# Altium schematic sheet Sheet1.SchDoc
size A4
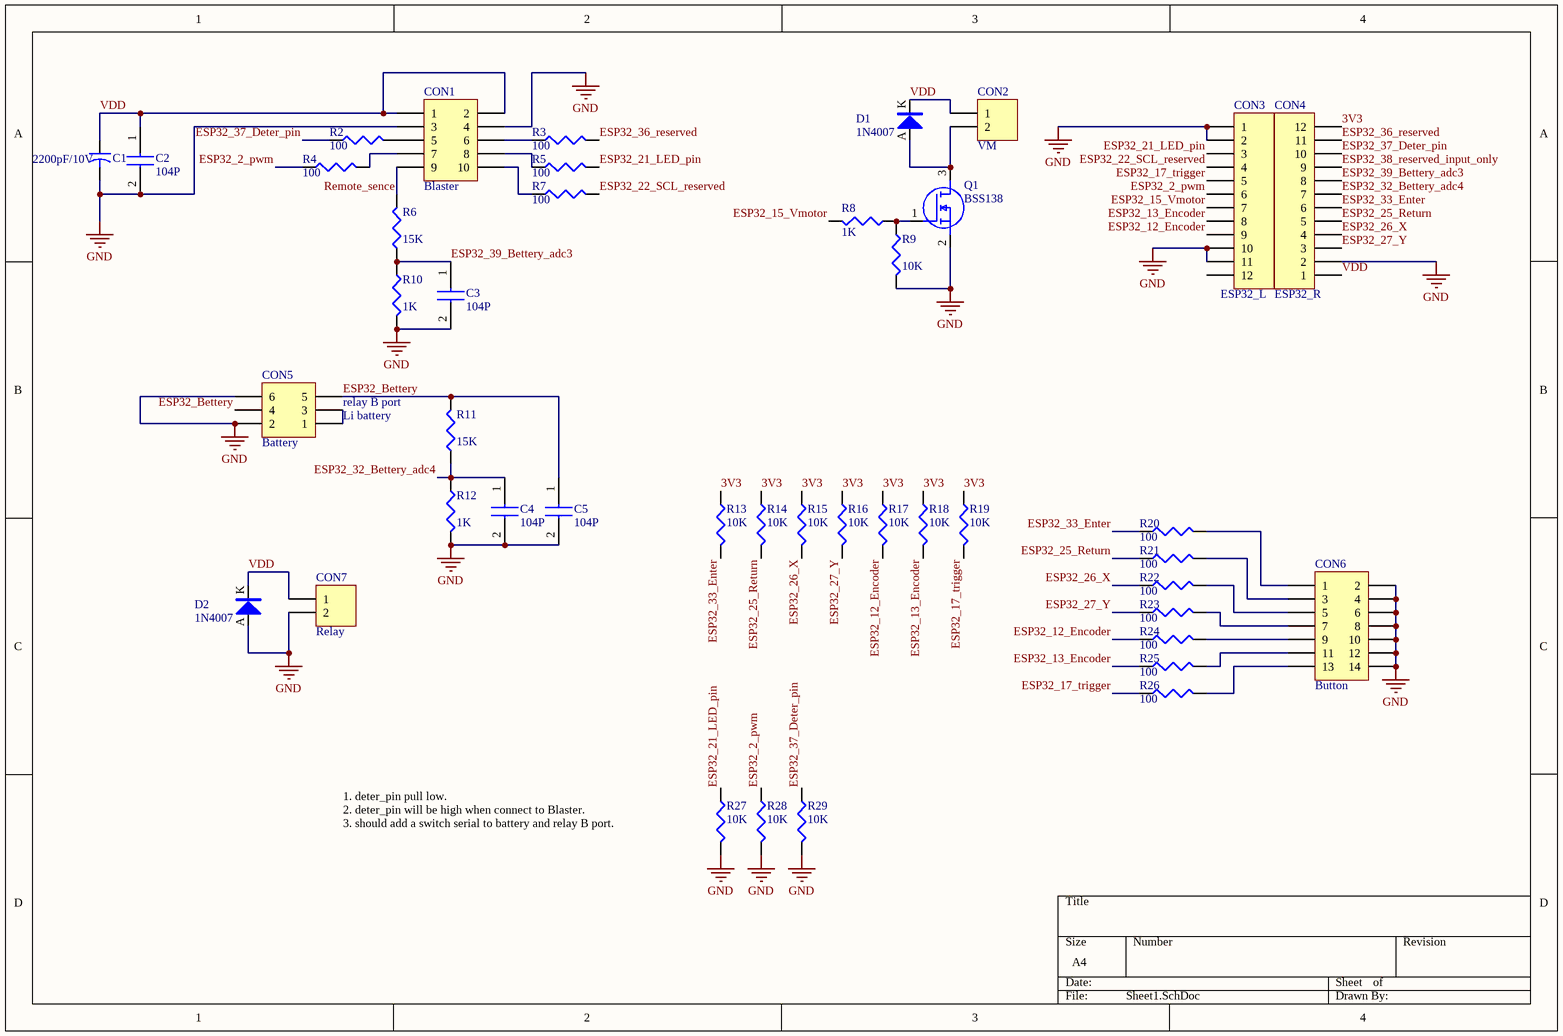
[diagram p0: Sheet1.SchDoc]

## Parts
C1  value 2200pF/10V  [CAPR5-4X5]  (hidden comment: Cap2)
C2  104P  [CAPC1608X90N]
C3  104P  [CAPC1608X90N]
C4  104P  [CAPC1608X90N]
C5  104P  [CAPC1608X90N]
CON1  Blaster  [HDR2X5]
CON2  VM  [HDR1X2]
CON3  ESP32_L  [HDR1X12]
CON4  ESP32_R  [HDR1X12]
CON5  Battery  [HDR2X3]
CON6  Button  [HDR2X7]
CON7  Relay  [HDR1X2]
D1  1N4007  [D3216]
D2  1N4007  [D3216]
Q1  BSS138  [SOT95P240X120-3N]
R2  value 100  [J1-0603]  (hidden comment: Res3)
R3  value 100  [J1-0603]  (hidden comment: Res3)
R4  value 100  [J1-0603]  (hidden comment: Res3)
R5  value 100  [J1-0603]  (hidden comment: Res3)
R6  value 15K  [J1-0603]  (hidden comment: Res3)
R7  value 100  [J1-0603]  (hidden comment: Res3)
R8  value 1K  [J1-0603]  (hidden comment: Res3)
R9  value 10K  [J1-0603]  (hidden comment: Res3)
R10  value 1K  [J1-0603]  (hidden comment: Res3)
R11  value 15K  [J1-0603]  (hidden comment: Res3)
R12  value 1K  [J1-0603]  (hidden comment: Res3)
R13  value 10K  [J1-0603]  (hidden comment: Res3)
R14  value 10K  [J1-0603]  (hidden comment: Res3)
R15  value 10K  [J1-0603]  (hidden comment: Res3)
R16  value 10K  [J1-0603]  (hidden comment: Res3)
R17  value 10K  [J1-0603]  (hidden comment: Res3)
R18  value 10K  [J1-0603]  (hidden comment: Res3)
R19  value 10K  [J1-0603]  (hidden comment: Res3)
R20  value 100  [J1-0603]  (hidden comment: Res3)
R21  value 100  [J1-0603]  (hidden comment: Res3)
R22  value 100  [J1-0603]  (hidden comment: Res3)
R23  value 100  [J1-0603]  (hidden comment: Res3)
R24  value 100  [J1-0603]  (hidden comment: Res3)
R25  value 100  [J1-0603]  (hidden comment: Res3)
R26  value 100  [J1-0603]  (hidden comment: Res3)
R27  value 10K  [J1-0603]  (hidden comment: Res3)
R28  value 10K  [J1-0603]  (hidden comment: Res3)
R29  value 10K  [J1-0603]  (hidden comment: Res3)

## Nets
GND: C1.2 C2.2 C3.2 C4.2 C5.2 CON1.3 CON1.4 CON3.1 CON3.2 CON3.10 CON3.11 CON4.2 CON5.2 CON5.6 CON6.2 CON6.4 CON6.6 CON6.8 CON6.10 CON6.12 CON6.14 CON7.2 D2.A Q1.2(S) R9.2 R10.2 R12.2 R27.2 R28.2 R29.2
3V3: CON4.12 R13.1 R14.1 R15.1 R16.1 R17.1 R18.1 R19.1
ESP32_2_pwm: CON3.6 R4.1 R28.1
ESP32_12_Encoder: CON3.9 R17.2 R24.1
ESP32_13_Encoder: CON3.8 R18.2 R25.1
ESP32_15_Vmotor: CON3.7 R8.2
ESP32_17_trigger: CON3.5 R19.2 R26.1
ESP32_21_LED_pin: CON3.3 R5.2 R27.1
ESP32_22_SCL_reserved: CON3.4 R7.2
ESP32_25_Return: CON4.5 R14.2 R21.1
ESP32_26_X: CON4.4 R15.2 R22.1
ESP32_27_Y: CON4.3 R16.2 R23.1
ESP32_32_Bettery_adc4: C4.1 CON4.7 R11.1 R12.1
ESP32_33_Enter: CON4.6 R13.2 R20.1
ESP32_36_reserved: CON4.11 R3.2
ESP32_37_Deter_pin: CON4.10 R2.1 R29.1
ESP32_38_reserved_input_only: CON4.9
ESP32_39_Bettery_adc3: C3.1 CON4.8 R6.1 R10.1
ESP32_Bettery: C5.1 CON5.4 CON5.5 R11.2
Remote_sence: CON1.9 R6.2
VDD: C1.1 C2.1 CON1.1 CON1.2 CON2.1 CON4.1 CON7.1 D1.K D2.K
NetCON1_5: CON1.5 R2.2
NetCON1_6: CON1.6 R3.1
NetCON1_7: CON1.7 R4.2
NetCON1_8: CON1.8 R5.1
NetCON1_10: CON1.10 R7.1
NetCON2_2: CON2.2 D1.A Q1.3(D)
NetCON5_1: CON5.1 CON5.3
NetCON6_1: CON6.1 R20.2
NetCON6_3: CON6.3 R21.2
NetCON6_5: CON6.5 R22.2
NetCON6_7: CON6.7 R23.2
NetCON6_9: CON6.9 R24.2
NetCON6_11: CON6.11 R25.2
NetCON6_13: CON6.13 R26.2
NetQ1_1: Q1.1(G) R8.1 R9.1

Not connected (* = marked no-connect by the designer): CON3 12

## Notes on the sheet
- relay B port
- (near CON5) Li battery
- 1. deter_pin pull low.
  2. deter_pin will be high when connect to Blaster.
  3. should add a switch serial to battery and relay B port.

## Library data of the parts
C1 = Cap2: Capacitor; Published: 23-Sep-2002; PackageReference: CAPR5-4X5; Publisher: Altium Limited; PackageDescription: Capacitor; 2 Leads
C2-C5 = CC0603KRX7R7BB103: Capacitor; Manufacturer_Name: YAGEO (PHYCOMP); Datasheet Link: http://www.yageo.com/documents/recent/UPY-GPHC_X7R_6.3V-to-50V_18.pdf; Height: 0.9mm; Manufacturer_Part_Number: CC0603KRX7R7BB103; Arrow Part Number: CC0603KRX7R7BB103; Arrow Price/Stock: https://www.arrow.com/en/products/cc0603krx7r7bb103/yageo; Mouser Part Number: 603-CC603KRX7R7BB103; Mouser Price/Stock: https://www.mouser.co.uk/ProductDetail/Yageo/CC0603KRX7R7BB103?qs=5q%252BqlK8CmJRarFmz5k060w%3D%3D
CON1 = Header 5X2: Header, 5-Pin, Dual row; LatestRevisionDate: 17-Jul-2002; LatestRevisionNote: Re-released for DXP Platform.; Publisher: Altium Limited
CON2 CON7 = Header 2: Header, 2-Pin; LatestRevisionDate: 17-Jul-2002; LatestRevisionNote: Re-released for DXP Platform.; Publisher: Altium Limited
CON3 CON4 = Header 12: Header, 12-Pin; LatestRevisionDate: 17-Jul-2002; LatestRevisionNote: Re-released for DXP Platform.; Publisher: Altium Limited
CON5 = Header 3X2: Header, 3-Pin, Dual row; LatestRevisionDate: 17-Jul-2002; LatestRevisionNote: Re-released for DXP Platform.; Publisher: Altium Limited
CON6 = Header 7X2: Header, 7-Pin, Dual row; LatestRevisionDate: 17-Jul-2002; LatestRevisionNote: Re-released for DXP Platform.; Publisher: Altium Limited
D1 D2 = SMD-D
Q1 = BSS138: MOSFET (N-Channel); Manufacturer_Name: ON Semiconductor; Datasheet Link: https://www.onsemi.com/pub/Collateral/BSS138-D.PDF; Height: 1.2mm; Manufacturer_Part_Number: BSS138; Arrow Part Number: BSS138; Arrow Price/Stock: https://www.arrow.com/en/products/bss138/on-semiconductor; Mouser Part Number: 512-BSS138; Mouser Price/Stock: https://www.mouser.co.uk/ProductDetail/ON-Semiconductor-Fairchild/BSS138?qs=HK%252BeIG1iaahCeqBvjB4arg%3D%3D
R2-R29 = Res3: Resistor; Published: 8-Jun-2000; LatestRevisionDate: 29-May-2009; LatestRevisionNote: IPC-7351 Footprint Added.; PackageReference: J1-0603; Publisher: Altium Limited; PackageDescription: Chip Resistor